# EAGLE design StappenMotorSturing (EAGLE 6.4)
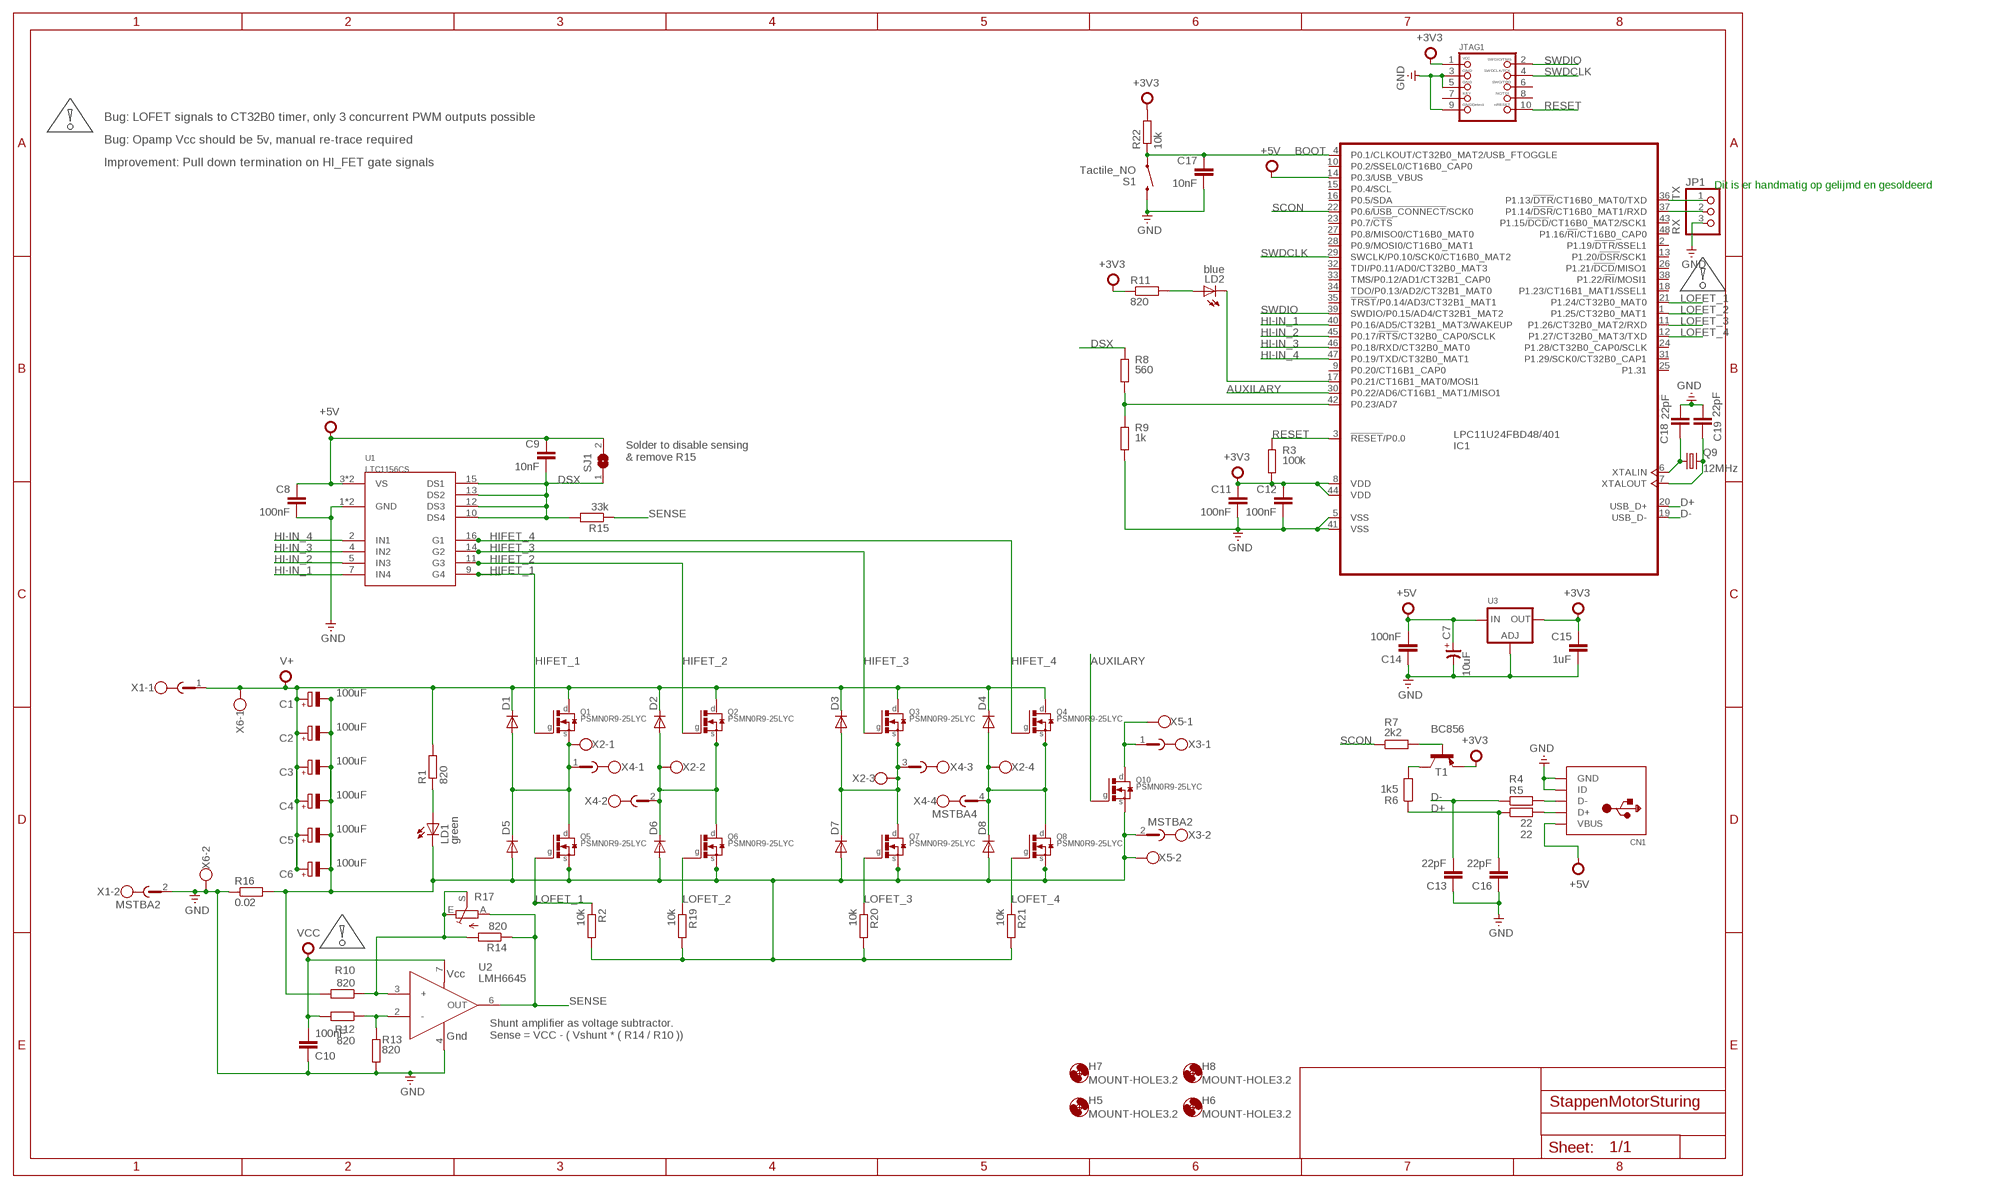
[diagram p0: schematic, sheet 1]

## Parts
C1  100uF  CPOL-EUE2.5-7  [E2,5-7]
C2  100uF  CPOL-EUE2.5-7  [E2,5-7]
C3  100uF  CPOL-EUE2.5-7  [E2,5-7]
C4  100uF  CPOL-EUE2.5-7  [E2,5-7]
C5  100uF  CPOL-EUE2.5-7  [E2,5-7]
C6  100uF  CPOL-EUE2.5-7  [E2,5-7]
C7  10uF  CP-3216-18W  [3216-18W/T]
C8  100nF  C-EUC0805  [C0805]
C9  10nF  C-EUC0805  [C0805]
C10  100nF  C-EUC0805  [C0805]
C11  100nF  C-EUC0805  [C0805]
C12  100nF  C-EUC0805  [C0805]
C13  22pF  C-EUC0805  [C0805]
C14  100nF  C-EUC0805  [C0805]
C15  1uF  C-EUC0805  [C0805]
C16  22pF  C-EUC0805  [C0805]
C17  10nF  C-EUC0805  [C0805]
C18  22pF  C-EUC0805  [C0805]
C19  22pF  C-EUC0805  [C0805]
CN1  USBMINIB  [USB-MINIB]
D1  DIODE-SOD80C  [SOD80C]
D2  DIODE-SOD80C  [SOD80C]
D3  DIODE-SOD80C  [SOD80C]
D4  DIODE-SOD80C  [SOD80C]
D5  DIODE-SOD80C  [SOD80C]
D6  DIODE-SOD80C  [SOD80C]
D7  DIODE-SOD80C  [SOD80C]
D8  DIODE-SOD80C  [SOD80C]
H5  MOUNT-HOLE3.2  [3,2]
H6  MOUNT-HOLE3.2  [3,2]
H7  MOUNT-HOLE3.2  [3,2]
H8  MOUNT-HOLE3.2  [3,2]
IC1  LPC11U24FBD48/401  [LQFP48]
JP1  HEADER-1X3  [1X03_OVAL]
JTAG1  JTAG-CORTEXM3  [2X05_1.27MM_SMT]
LD1  green  LEDCHIP-LED0805  [CHIP-LED0805]
LD2  blue  LEDCHIP-LED0805  [CHIP-LED0805]
Q1  PSMN0R9-25LYC  PSMN2R6-40YS  [SOT669]
Q2  PSMN0R9-25LYC  PSMN2R6-40YS  [SOT669]
Q3  PSMN0R9-25LYC  PSMN2R6-40YS  [SOT669]
Q4  PSMN0R9-25LYC  PSMN2R6-40YS  [SOT669]
Q5  PSMN0R9-25LYC  PSMN2R6-40YS  [SOT669]
Q6  PSMN0R9-25LYC  PSMN2R6-40YS  [SOT669]
Q7  PSMN0R9-25LYC  PSMN2R6-40YS  [SOT669]
Q8  PSMN0R9-25LYC  PSMN2R6-40YS  [SOT669]
Q9  12MHz  CRYSTAL5X3  [CRYSTAL-SMD-5X3]
Q10  PSMN0R9-25LYC  PSMN2R6-40YS  [SOT669]
R1  820  R-EU_R0805  [R0805]
R2  10k  R-EU_R0805  [R0805]
R3  100k  R-EU_R0805  [R0805]
R4  22  R-EU_R0805  [R0805]
R5  22  R-EU_R0805  [R0805]
R6  1k5  R-EU_R0805  [R0805]
R7  2k2  R-EU_R0805  [R0805]
R8  560  R-EU_R0805  [R0805]
R9  1k  R-EU_R0805  [R0805]
R10  820  R-EU_R0805  [R0805]
R11  820  R-EU_R0805  [R0805]
R12  820  R-EU_R0805  [R0805]
R13  820  R-EU_R0805  [R0805]
R14  820  R-EU_R0805  [R0805]
R15  33k  R-EU_R0805  [R0805]
R16  0.02  R-EU_R2512  [R2512]
R17  TRIM_EU-RS3  [RS3]
R19  10k  R-EU_R0805  [R0805]
R20  10k  R-EU_R0805  [R0805]
R21  10k  R-EU_R0805  [R0805]
R22  10k  R-EU_R0805  [R0805]
S1  Tactile_NO  SPARKFUN_TACTILE_MINI  [SPARKFUN_TACTILE_MINI]
SJ1  SJ  [SJ]
T1  BC856  BC856A-PNP-SOT23-BEC  [SOT23-BEC]
U1  LTC1156CS  [SOL16]
U2  LMH6645  [SOIC8]
U3  LM1117SOT223-WAVE  [SOT223-W]
X1  MSTBA2  [MSTBA2]
X2  W237-4  [W237-4]
X3  MSTBA2  [MSTBA2]
X4  MSTBA4  [MSTBA4]
X5  W237-102  [W237-102]
X6  W237-102  [W237-102]

## Nets
+3V3: C11.1 C12.1 C15.1 IC1.8(VDD) IC1.44(VDD) JTAG1.1 R3.2 R11.1 R22.2 T1.E U3.2(OUT)
+5V: C7.+ C8.1 C9.1 C14.2 CN1.VBUS IC1.14(P0.3/USB_VBUS) SJ1.2 U1.3(VS) U1.8(VS) U3.3(IN)
AUX+: Q10.5(D) X3.1 X5.1
AUXILARY: IC1.30(P0.22/AD6/CT16B1_MAT1/MISO1) Q10.4(G)
BOOT: C17.1 IC1.4(P0.1/CLKOUT/CT32B0_MAT2/USB_FTOGGLE) R22.1 S1.P$1
D+: C16.1 IC1.20(USB_D+) R5.1 R6.1
D-: C13.2 IC1.19(USB_D-) R4.1
DSX: C9.2 R8.1 R15.2 SJ1.1 U1.10(DS4) U1.12(DS3) U1.13(DS2) U1.15(DS1)
GND: C7.- C8.2 C10.1 C11.2 C12.2 C13.1 C14.1 C15.2 C16.2 C17.2 C18.1 C19.1 CN1.GND CN1.ID IC1.5(VSS) IC1.41(VSS) JP1.3 JTAG1.3 JTAG1.5 JTAG1.9 R9.2 R13.2 R16.1 S1.P$2 U1.1(GND) U1.6(GND) U2.4(GND) U3.1(ADJ) X1.2 X6.2
HI-IN_1: IC1.40(P0.16/AD5/CT32B1_MAT3/WAKEUP) U1.7(IN4)
HI-IN_2: IC1.45(P0.17/!RTS!/CT32B0_CAP0/SCLK) U1.5(IN3)
HI-IN_3: IC1.46(P0.18/RXD/CT32B0_MAT0) U1.4(IN2)
HI-IN_4: IC1.47(P0.19/TXD/CT32B0_MAT1) U1.2(IN1)
HIFET_1: Q1.4(G) U1.9(G4)
HIFET_2: Q2.4(G) U1.11(G3)
HIFET_3: Q3.4(G) U1.14(G2)
HIFET_4: Q4.4(G) U1.16(G1)
LOFET_1: IC1.21(P1.24/CT32B0_MAT0) Q5.4(G) R2.1
LOFET_2: IC1.1(P1.25/CT32B0_MAT1) Q6.4(G) R19.1
LOFET_3: IC1.11(P1.26/CT32B0_MAT2/RXD) Q7.4(G) R20.1
LOFET_4: IC1.12(P1.27/CT32B0_MAT3/TXD) Q8.4(G) R21.1
N$1: R10.1 R14.2 R17.E R17.S U2.3(+)
N$3: D1.A D5.C Q1.1(S) Q1.2(S) Q1.3(S) Q5.5(D) X2.1 X4.1
N$4: D2.A D6.C Q2.1(S) Q2.2(S) Q2.3(S) Q6.5(D) X2.2 X4.2
N$5: LD2.A R11.2
N$6: D4.A D8.C Q4.1(S) Q4.2(S) Q4.3(S) Q8.5(D) X2.4 X4.4
N$7: D3.A D7.C Q3.1(S) Q3.2(S) Q3.3(S) Q7.5(D) X2.3 X4.3
N$8: R12.1 R13.1 U2.2(-)
N$9: IC1.17(P0.21/CT16B1_MAT0/MOSI1) LD2.C
N$11: C1.- C2.- C3.- C4.- C5.- C6.- D5.A D6.A D7.A D8.A LD1.C Q5.1(S) Q5.2(S) Q5.3(S) Q6.1(S) Q6.2(S) Q6.3(S) Q7.1(S) Q7.2(S) Q7.3(S) Q8.1(S) Q8.2(S) Q8.3(S) Q10.3(S) R2.2 R10.2 R16.2 R19.2 R20.2 R21.2 X3.2 X5.2
N$13: LD1.A R1.1
N$14: CN1.D+ R5.2
N$15: CN1.D- R4.2
N$16: R6.2 T1.C
N$17: R7.2 T1.B
N$18: C18.2 IC1.6(XTALIN) Q9.1
N$19: C19.2 IC1.7(XTALOUT) Q9.3
N$27: IC1.42(P0.23/AD7) R8.2 R9.1
RESET: IC1.3(!RESET!/P0.0) JTAG1.10 R3.1
RX: IC1.37(P1.14/!DSR!/CT16B0_MAT1/RXD) JP1.2
SCON: IC1.22(P0.6/!USB_CONNECT!/SCK0) R7.1
SENSE: R14.1 R15.1 R17.A U2.6(OUT)
SWDCLK: IC1.29(SWCLK/P0.10/SCK0/CT16B0_MAT2) JTAG1.4
SWDIO: IC1.39(SWDIO/P0.15/AD4/CT32B1_MAT2) JTAG1.2
TX: IC1.36(P1.13/!DTR!/CT16B0_MAT0/TXD) JP1.1
V+: C1.+ C2.+ C3.+ C4.+ C5.+ C6.+ D1.C D2.C D3.C D4.C Q1.5(D) Q2.5(D) Q3.5(D) Q4.5(D) R1.2 X1.1 X6.1
VCC: C10.2 R12.2 U2.7(VCC)
Unconnected: IC1.2(P1.19/!DTR!/SSEL1) IC1.9(P0.20/CT16B1_CAP0) IC1.10(P0.2/SSEL0/CT16B0_CAP0) IC1.13(P1.20/!DSR!/SCK1) IC1.15(P0.4/SCL) IC1.16(P0.5/SDA) IC1.18(P1.23/CT16B1_MAT1/SSEL1) IC1.23(P0.7/!CTS!) IC1.24(P1.28/CT32B0_CAP0/SCLK) IC1.25(P1.31) IC1.26(P1.21/!DCD!/MISO1) IC1.27(P0.8/MISO0/CT16B0_MAT0) IC1.28(P0.9/MOSI0/CT16B0_MAT1) IC1.31(P1.29/SCK0/CT32B0_CAP1) IC1.32(TDI/P0.11/AD0/CT32B0_MAT3) IC1.33(TMS/P0.12/AD1/CT32B1_CAP0) IC1.34(TDO/P0.13/AD2/CT32B1_MAT0) IC1.35(!TRST!/P0.14/AD3/CT32B1_MAT1) IC1.38(P1.22/!RI!/MOSI1) IC1.43(P1.15/!DCD!/CT16B0_MAT2/SCK1) IC1.48(P1.16/!RI!/CT16B0_CAP0) JTAG1.6 JTAG1.7 JTAG1.8 Q10.1(S) Q10.2(S)

## Notes on the sheet
- Bug: LOFET signals to CT32B0 timer, only 3 concurrent PWM outputs possible
- Bug: Opamp Vcc should be 5v, manual re-trace required
- Improvement: Pull down termination on HI_FET gate signals
- Dit is er handmatig op gelijmd en gesoldeerd
- Solder to disable sensing
  & remove R15
- Shunt amplifier as voltage subtractor.
  Sense = VCC - ( Vshunt * ( R14 / R10 ))

## Library data of the parts
C1-C6 = rcl:CPOL-EU: POLARIZED CAPACITOR, European symbol
C7 = cap-master:CP-: POLARIZED CAP
C8-C19 = rcl:C-EU: CAPACITOR, European symbol
CN1 = microbuilder:USB: USB Connectors USBMINIB - Surface Mount Female Mini-B USB Connector 4UConnector: 06564
D1-D8 = diode:DIODE-: DIODE
H5-H8 = holes:MOUNT-HOLE: MOUNTING HOLE with drill center marker
IC1 = lpc11u24fbd48:LPC11U24FBD48
JP1 = microbuilder:HEADER-1X3: PIN HEADER
JTAG1 = microbuilder:JTAG-CORTEXM3: Serial Wire (SW-DP) Connector This standard 0.05" 10-pin connector is for use with the Cortex M0/M3's native SWD (serial wire debugger) interface (SW-DP). Some boards support a 20-pin combined JTAG+SWD connector (SWJ-DP), such as the LPC1700 family, but many smaller devices only work with SWD which typically use the smaller 10-pin SW-DP connecter (the LPC1300 family, for example, only supports SWD). 2x05 1.27mm/0.05" Connector: This is the standard SMT connector defined by ARM for all Cortex devices, and should be used in most situations and for forward-compatibility since any new devices coming to market will likely use this connector. MOLEX 10 Pin 0.1" Connector: This 0.1" 10 pin connector has the same pin layout as the standard 0.05" connector, but is easier to work with if you are using standard jumper wires or custom cables to connect your SWD hardware. MOLEX 20 Pin 0.1" Connector: This 0.1" 20 pin connector is the same model used for ARM7/ARM9 JTAG debuggers, but is connected to match the pins on the Segger J-Link for ARM (which supports both JTAG and SWD debugging). See the following document from ARM for more information on Cortex M3 Debug Connectors: http://infocenter.arm.com/help/topic/com.arm.doc.faqs/attached/13634/cortex_debug_connectors.pdf And the following page for an overview with images of the different connector types: http://www.keil.com/peripherals/coresight/connectors.asp
LD1 LD2 = led:LED: LED OSRAM: - CHIPLED LG R971, LG N971, LY N971, LG Q971, LY Q971, LO R971, LY R971 LH N974, LH R974 LS Q976, LO Q976, LY Q976 LO Q996 - Hyper CHIPLED LW Q18S LB Q993, LB Q99A, LB R99A - SideLED LS A670, LO A670, LY A670, LG A670, LP A670 LB A673, LV A673, LT A673, LW A673 LH A674 LY A675 LS A676, LA A676, LO A676, LY A676, LW A676 LS A679, LY A679, LG A679 - Hyper Micro SIDELED® LS Y876, LA Y876, LO Y876, LY Y876 LT Y87S - SmartLED LW L88C, LW L88S LB L89C, LB L89S, LG L890 LS L89K, LO L89K, LY L89K LS L896, LA L896, LO L896, LY L896 - TOPLED LS T670, LO T670, LY T670, LG T670, LP T670 LSG T670, LSP T670, LSY T670, LOP T670, LYG T670 LG T671, LOG T671, LSG T671 LB T673, LV T673, LT T673, LW T673 LH T674 LS T676, LA T676, LO T676, LY T676, LB T676, LH T676, LSB T676, LW T676 LB T67C, LV T67C, LT T67C, LS T67K, LO T67K, LY T67K, LW E67C LS E67B, LA E67B, LO E67B, LY E67B, LB E67C, LV E67C, LT E67C LW T67C LS T679, LY T679, LG T679 LS T770, LO T770, LY T770, LG T770, LP T770 LB T773, LV T773, LT T773, LW T773 LH T774 LS E675, LA E675, LY E675, LS T675 LS T776, LA T776, LO T776, LY T776, LB T776 LHGB T686 LT T68C, LB T68C - Hyper Mini TOPLED® LB M676 - Mini TOPLED Santana® LG M470 LS M47K, LO M47K, LY M47K Source: http://www.osram.convergy.de/
Q1-Q8 Q10 = NXP_FETS:PSMN2R6-40YS
Q9 = SparkFun:CRYSTAL: Crystals Various standard crystals. Proven footprints. Spark Fun Electronics SKU : COM-00534
R1-R15 R19-R22 = resistor:R-EU_: RESISTOR, European symbol
R16 = rcl:R-EU_: RESISTOR, European symbol
R17 = pot:TRIM_EU-: POTENTIOMETER
S1 = Q_copter:SPARKFUN_TACTILE_MINI: Momentary Reset Switch SMD sku: COM-08229
SJ1 = jumper:SJ: SMD solder JUMPER
T1 = transistor:*-PNP-: PNP Transistror
U1 = Jeroen:LTC1156: LTC1156 Quad High Side Micropower MOSFET Driver with Internal Charge Pump in SOL16 or DIP16 package
U2 = Jeroen:LMH6645: LMH6645/46/47 2.7V, 650μA, 55MHz, Rail-to-Rail Input and Output Amplifiers
U3 = microbuilder:LM1117: LM1117 Voltage Regulator LM1117 Adjustable Voltage regulator [Digikey: LM1117IMP-ADJDKR-ND] LM1117 3.3V Voltage regulator [AP1117E33GDIDKR-ND] LM1117 5.0V Voltage regulator [AP1117E50GDIDKR-ND] SOT223-REFLOW - SOT223 package for solder paste/reflow ovens SOT223-WAVE - SOT223 package for hand-soldering (larger pads) Note: For the fixed-voltage regulators, simply set the ADJ pin to GND.
X1 X3 = con-phoenix-508:MSTBA2: PHOENIX
X2 = con-wago-500:W237-4: WAGO SCREW CLAMP
X4 = con-phoenix-508:MSTBA4: PHOENIX
X5 X6 = con-wago-500:W237-102: WAGO SCREW CLAMP

## Board
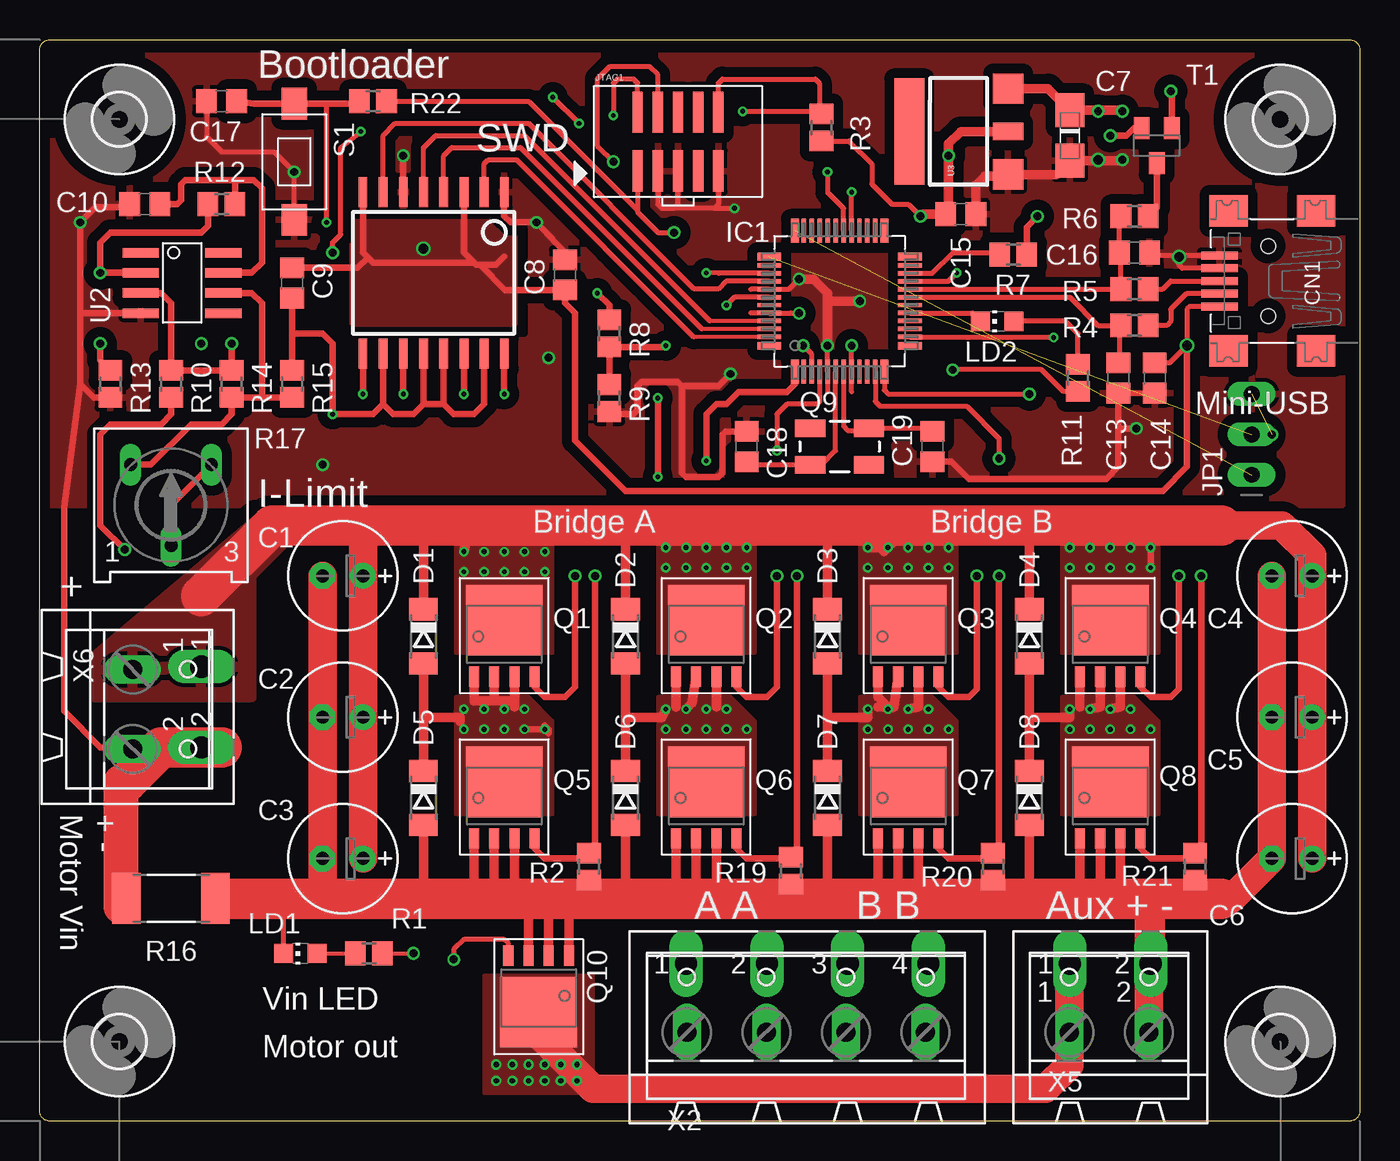
[diagram p1: board, top side]
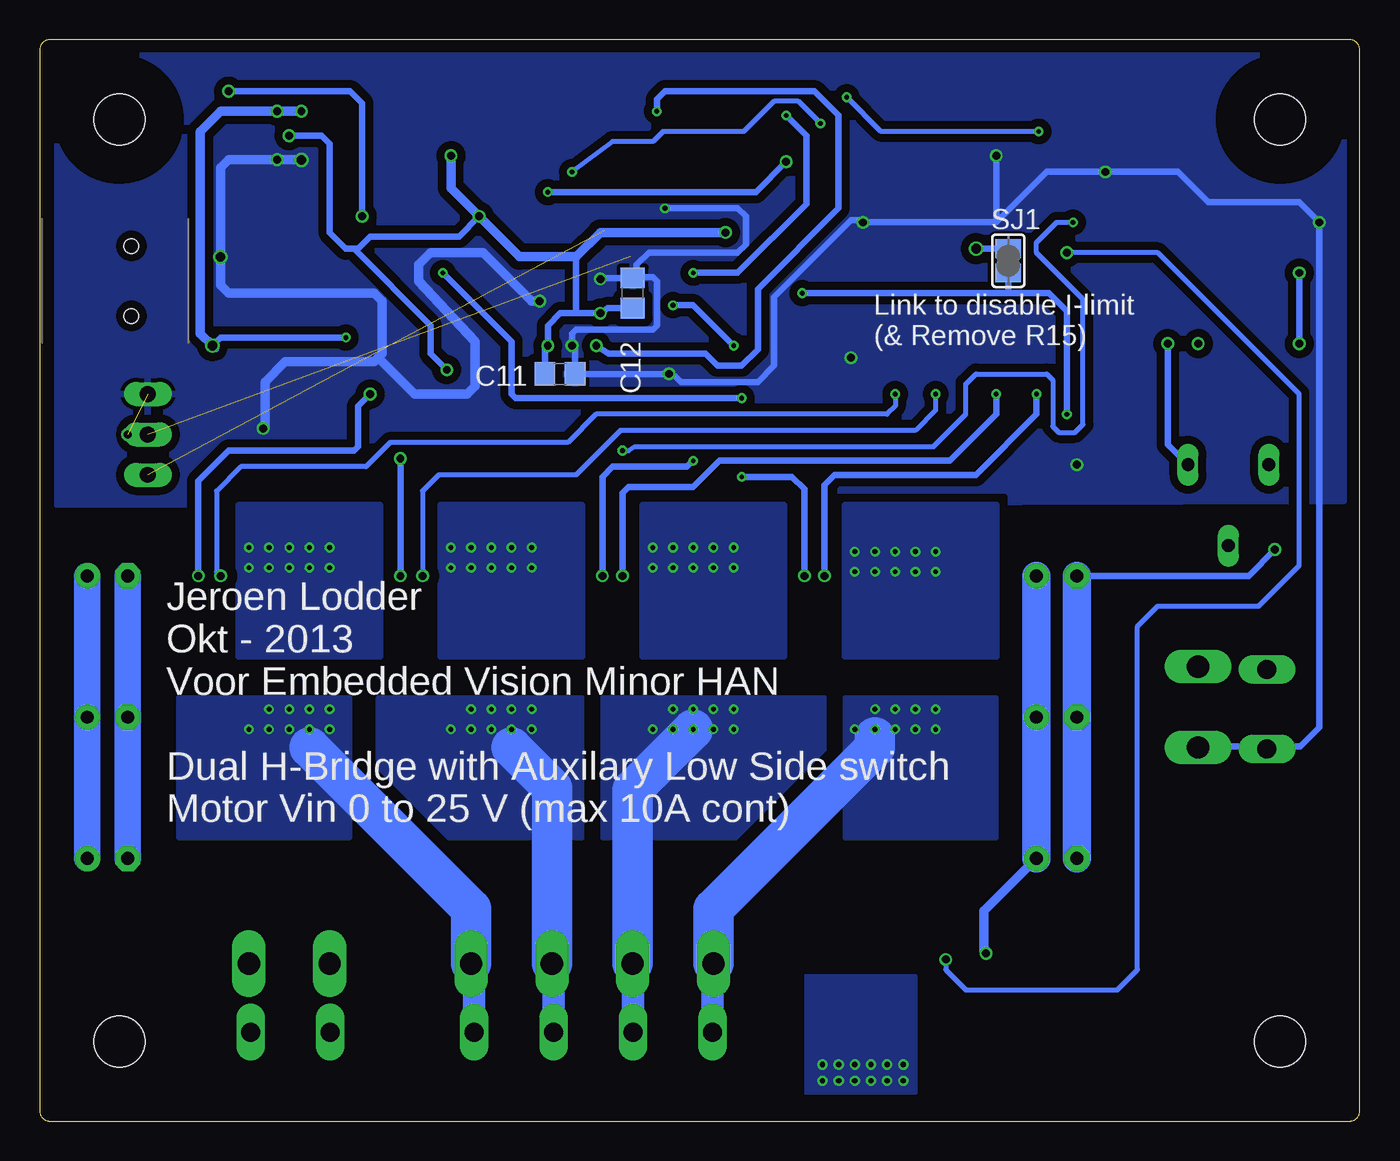
[diagram p2: board, bottom side, seen from below]

Size 83 x 68 mm. Coordinates in mm from the lower left corner, seen from the top.
Outline: 82.36,0 0.64,0 arc-90 0,0.64 0,67.36 arc-90 0.64,68 82.36,68 arc-90 83,67.36 83,0.64 arc-90 82.36,0
Copper layers (1*16): Top 0.035mm / dielectric 1.5mm / Bottom 0.035mm
Design rules "ITEADstudio_DRC": minimum track width 6mil, minimum drill 0.3mm, track to track 6mil, track to pad 6mil, pad to pad 6mil, via to via 6mil, smd to smd 0mil, copper to edge 10mil, drill to drill 10mil, minimum pad ring 10mil, minimum via ring 6mil, stop-mask expansion 2mil, vias tented up to drill 100mil, thermal gap 10mil

### Footprints (pad centres in the part's own frame; a part is rotated, then mirrored left to right if it is on the bottom)
E2,5-7 = drill 0.813 pad 1.6: + -1.27,0 | drill 0.813 pad 1.6 octagon: - 1.27,0
3216-18W/T = smd 2.15 x 1.8: + 1.587,0; - -1.587,0
C0805 = smd 1.3 x 1.5: 1 -0.95,0; 2 0.95,0
USB-MINIB = smd 0.5 x 2.308: D+ 0,4.064; D- -0.8,4.064; GND 1.6,4.064; ID 0.8,4.064; VBUS -1.6,4.064 | smd 2 x 2.4: GND1 -4.4,-2; GND2 -4.4,3.5; GND3 4.4,3.5; GND4 4.4,-2 | hole 0.9: -2.2,1; 2.2,1
SOD80C = smd 1.4 x 1.8: A 1.7,0; C -1.7,0
3,2 = hole 3.2: 0,0
LQFP48 = smd 0.5 x 1.5: 1 -2.81,-4.425; 12 2.81,-4.425; 25 2.81,4.425; 36 -2.81,4.425 | smd 0.28 x 1.5: 2 -2.25,-4.425; 3 -1.75,-4.425; 4 -1.25,-4.425; 5 -0.75,-4.425; 6 -0.25,-4.425; 7 0.25,-4.425; 8 0.75,-4.425; 9 1.25,-4.425; 10 1.75,-4.425; 11 2.25,-4.425; 26 2.25,4.425; 27 1.75,4.425; 28 1.25,4.425; 29 0.75,4.425; 30 0.25,4.425; 31 -0.25,4.425; 32 -0.75,4.425; 33 -1.25,4.425; 34 -1.75,4.425; 35 -2.25,4.425 | smd 1.5 x 0.5: 13 4.425,-2.81; 24 4.425,2.81; 37 -4.425,2.81; 48 -4.425,-2.81 | smd 1.5 x 0.28: 14 4.425,-2.25; 15 4.425,-1.75; 16 4.425,-1.25; 17 4.425,-0.75; 18 4.425,-0.25; 19 4.425,0.25; 20 4.425,0.75; 21 4.425,1.25; 22 4.425,1.75; 23 4.425,2.25; 38 -4.425,2.25; 39 -4.425,1.75; 40 -4.425,1.25; 41 -4.425,0.75; 42 -4.425,0.25; 43 -4.425,-0.25; 44 -4.425,-0.75; 45 -4.425,-1.25; 46 -4.425,-1.75; 47 -4.425,-2.25
1X03_OVAL = drill 1 long: 1 -2.54,0; 2 0,0; 3 2.54,0
2X05_1.27MM_SMT = smd 0.65 x 2.6: 1 -2.54,-1.85; 2 -2.54,1.85; 3 -1.27,-1.85; 4 -1.27,1.85; 5 0,-1.85; 6 0,1.85; 7 1.27,-1.85; 8 1.27,1.85; 9 2.54,-1.85; 10 2.54,1.85
CHIP-LED0805 = smd 1.2 x 1.2: A 0,-1.05; C 0,1.05
SOT669 = smd 0.635 x 1.27: 1 0,0; 2 1.27,0; 3 2.54,0; 4 3.81,0 | smd 4.826 x 4.445: 5 1.905,3.556
CRYSTAL-SMD-5X3 = smd 1.9 x 1.1: 1 -1.85,-1.15; 2 1.85,-1.15; 3 1.85,1.15; 4 -1.85,1.15
R0805 = smd 1.3 x 1.5: 1 -0.85,0; 2 0.85,0
R2512 = smd 1.8 x 3.2: 1 -2.8,0; 2 2.8,0
RS3 = drill 0.813 long: A -2.54,2.54; E 2.54,2.54; S 0,-2.54
SPARKFUN_TACTILE_MINI = smd 2 x 1.6: P$1 -3.65,0; P$2 3.65,0
SJ = smd 1.168 x 1.6: 1 -0.762,0; 2 0.762,0
SOT23-BEC = smd 1 x 1.4: B -0.95,-1.1; C 0,1.1; E 0.95,-1.1
SOL16 = smd 0.559 x 1.905: 1 -4.445,-5.08; 2 -3.175,-5.08; 3 -1.905,-5.08; 4 -0.635,-5.08; 5 0.635,-5.08; 6 1.905,-5.08; 7 3.175,-5.08; 8 4.445,-5.08; 9 4.445,5.08; 10 3.175,5.08; 11 1.905,5.08; 12 0.635,5.08; 13 -0.635,5.08; 14 -1.905,5.08; 15 -3.175,5.08; 16 -4.445,5.08
SOIC8 = smd 0.6 x 2.27: 1 -1.905,-2.54; 2 -0.635,-2.54; 3 0.635,-2.54; 4 1.905,-2.54; 5 1.905,2.66; 6 0.635,2.66; 7 -0.635,2.66; 8 -1.905,2.66
SOT223-W = smd 1.9 x 1.9: 1 -2.7,-3.1; 3 2.7,-3.1 | smd 1.1 x 1.9: 2 0,-3.1 | smd 6.7 x 1.9: 4 0,3.1
MSTBA2 = drill 1.397 long: 1 -2.54,5.08; 2 2.54,5.08
W237-4 = drill 1.194 long: 1 -7.5,-1.27; 2 -2.5,-1.27; 3 2.5,-1.27; 4 7.5,-1.27
MSTBA4 = drill 1.397 long: 1 -7.62,5.08; 2 -2.54,5.08; 3 2.54,5.08; 4 7.62,5.08
W237-102 = drill 1.194 long: 1 -2.5,-1.27; 2 2.5,-1.27

### Placement (x,y rotation side)
C1  19.05,34.29 180 top
C2  19.05,25.4 180 top
C3  19.05,16.51 180 top
C4  78.74,34.29 180 top
C5  78.74,25.4 180 top
C6  78.74,16.51 180 top
C7  64.77,61.98 90 top
C8  33.02,53.21 90 top
C9  15.88,52.7 270 top
C10  6.6,57.66 0 top
C11  50.29,46.99 0 bottom
C12  45.72,52.07 90 bottom
C13  67.82,46.74 90 top
C14  70.1,46.74 90 top
C15  57.91,57.02 0 top
C16  68.83,54.61 0 top
C17  11.43,64.14 180 top
C18  44.45,42.42 270 top
C19  56.13,42.42 90 top
CN1  78.25,52.83 90 top
D1  24.13,30.48 270 top
D2  36.83,30.48 270 top
D3  49.53,30.48 270 top
D4  62.23,30.48 270 top
D5  24.13,20.32 270 top
D6  36.83,20.32 270 top
D7  49.53,20.32 270 top
D8  62.23,20.32 270 top
H5  5,5 0 top
H6  78,5 0 top
H7  78,63 0 top
H8  5,63 0 top
IC1  50.29,51.56 0 top
JP1  76.2,43.18 90 top
JTAG1  40.13,61.59 0 top
LD1  16.38,10.54 90 top
LD2  60.2,50.29 90 top
Q1  27.3,27.94 0 top
Q2  40.01,27.94 0 top
Q3  52.7,27.94 0 top
Q4  65.41,27.94 0 top
Q5  27.3,17.78 0 top
Q6  40.01,17.78 0 top
Q7  52.7,17.78 0 top
Q8  65.41,17.78 0 top
Q9  50.29,42.42 0 top
Q10  33.27,10.41 180 top
R1  20.7,10.54 0 top
R2  34.54,16 270 top
R3  49.15,62.48 270 top
R4  68.83,50.04 0 top
R5  68.83,52.32 0 top
R6  68.83,56.9 0 top
R7  61.21,54.48 0 top
R8  35.81,49.53 270 top
R9  35.81,45.47 270 top
R10  8.26,46.35 270 top
R11  65.28,46.74 90 top
R12  11.43,57.66 0 top
R13  4.45,46.35 270 top
R14  12.06,46.35 90 top
R15  15.88,46.35 90 top
R16  8.26,14 0 top
R17  8.26,38.73 0 top
R19  47.24,15.75 270 top
R20  59.94,16 270 top
R21  72.64,16 270 top
R22  20.95,64.14 0 top
S1  16,60.33 270 top
SJ1  22.1,54.1 90 bottom
T1  70.23,61.34 180 top
U1  24.77,53.34 180 top
U2  8.89,52.7 270 top
U3  57.78,62.23 90 top
X1  5.08,26.04 270 top
X2  48.19,6.86 0 top
X3  67.31,4.83 0 top
X4  48.26,4.83 0 top
X5  67.24,6.86 0 top
X6  7.11,25.91 270 top

### Tracks (layer width: path | path; a pad name or v marks a point on that pad's centre or on a via)
+3V3  (via drill 0.5)
  Top 0.305: JTAG1.1 37.59,57.28 | 37.59,57.28 37.59,57.15 38.86,55.88 v39.88,55.88 | 44.72,50.81 IC1.44 47.23,50.81 v47.75,50.8 | v51.05,48.77 51.04,49.01 IC1.8 51.04,45.87 | R3.2 50.89,61.63 52.32,60.2 52.32,58.93 53.59,57.66 54.61,57.66 v55.37,56.9 | R11.1 64.35,45.89 62.99,47.24 v57.4,47.24 | R22.2 30.73,64.14 37.59,57.28
  Top 0.406: T1.E 68.79,62.44 68.33,61.98 v67.31,61.98
  Top 0.61: U3.2 57.91,62.23 57.15,61.47 v57.15,60.71 57.15,57.21 C15.1 55.5,57.02 v55.37,56.9
  Bottom 0.305: 51.24,48.58 v51.05,48.77
  Bottom 0.406: 49.28,50.8 v47.75,50.8 47.31,51.12 C12.1 | 49.28,50.8 50.29,50.8 51.05,50.04 v51.05,48.77 | C11.1 51.24,48.58 | 49.28,54.36 49.28,50.8 | v67.31,61.98 65.28,61.98 64.77,61.47 64.77,55.88 63.75,54.86 63.25,54.86 | v57.4,47.24 58.42,48.26 58.42,50.04 63.25,54.86 | 63.25,54.86 62.99,54.86 62.23,55.63 56.64,55.63 v55.37,56.9
  Bottom 0.61: v39.88,55.88 47.75,55.88 49.28,54.36 52.83,54.36 v55.37,56.9 | v55.37,56.9 55.5,57.02 | v55.37,56.9 57.15,58.67 v57.15,60.71
+5V  (via drill 0.3, 0.5, 0.6)
  Top 0.305: CN1.VBUS 72.31,51.23 72.14,51.05 v72.14,48.77 71.05,47.69 C14.2 | 33.02,52.01 32.26,52.26 | IC1.14 63.72,49.31 v63.75,49.28
  Top 0.406: U1.3 26.67,54.61 27.3,53.98 | U1.8 20.32,54.61 20.64,54.29 | 20.64,54.29 20.95,53.98 27.3,53.98 | 20.64,54.29 20,53.66 C9.1 | 29.21,54.36 28.7,53.85 27.69,53.85 | 27.69,53.85 27.43,53.85 27.3,53.98 | C8.1 32.26,52.26 29.27,52.26 27.69,53.85 | v72.14,48.77 72.14,41.15 70.61,39.62 36.83,39.62 33.66,42.8 33.66,50.8 33.02,51.44 33.02,52.01
  Top 0.61: 66.99,63.56 C7.+ 63.4,64.93 U3.3 | 66.99,63.56 v66.55,63.5 | 66.99,63.56 68.01,63.56
  Bottom 0.305: 71.88,48.51 v72.14,48.77
  Bottom 0.406: v63.75,49.28 71.63,49.28 v72.14,48.77 | SJ1.2 v24.13,54.86
  Bottom 0.61: v72.14,48.77 72.9,49.53 72.9,62.23 71.63,63.5 v68.07,63.5 v66.55,63.5
  pour Top (isolate 0.635): 29.84,50.16 29.84,56.52 19.68,56.52 19.68,50.16
AUX+  (via drill 0.33)
  Top 1.778: X3.1 64.74,9.87 X5.1 64.74,3.52 63.25,2.03 34.8,2.03 30.73,6.1
  other vias: 29.72,2.54 28.7,3.56 28.7,2.54 30.73,3.56 29.72,3.56 31.75,2.54 30.73,2.54 32.77,2.54 31.75,3.56 32.77,3.56 33.78,3.56 33.78,2.54
  pour Top (isolate 0.127, no thermals): 27.94,9.14 27.94,1.78 34.8,1.78 34.8,9.14
  pour Bottom (isolate 0.127, no thermals): 27.94,9.14 27.94,1.78 34.8,1.78 34.8,9.14
AUXILARY  (via drill 0.3, 0.5)
  Top 0.305: IC1.30 50.54,57.41 49.53,58.42 v49.53,59.69 | Q10.4 29.46,11.18 29.21,11.43 26.67,11.43 26.04,10.79 v26.04,10.16 | v32.26,64.39 v33.91,62.74 | v20.19,62.23 18.92,61.21 18.92,55.75 18.41,55.24 v18.41,54.61
  Bottom 0.305: v26.04,10.16 26.04,9.53 24.77,8.26 15.24,8.26 13.97,9.53 13.97,31.11 12.7,32.38 6.35,32.38 3.81,34.92 3.81,45.72 12.7,54.61 v18.41,54.61 | v49.53,59.69 46.99,61.59 44.45,61.59 43.81,62.23 38.73,62.23 36.83,64.14 35.31,64.14 v33.91,62.74 | v32.26,64.39 30.1,62.23 v20.19,62.23
BOOT  (via drill 0.3)
  Top 0.305: IC1.4 49.04,45.23 48.9,45.09 46.99,45.09 46.35,44.45 v46.35,42.16 | v18.03,56.52 18.03,63.98
  Top 0.406: C17.1 13.49,63.98 S1.P$1 18.03,63.98 19.95,63.98 R22.1
  Bottom 0.305: v46.35,42.16 45.97,42.16 45.59,42.42 26.8,42.42 24.77,44.45 24.77,46.35 24.13,46.99 19.68,46.99 19.3,46.61 19.3,43.69 18.92,43.31 17.91,43.31 17.4,43.81 17.4,51.69 20.32,54.61 20.32,55.24 19.05,56.52 v18.03,56.52
D+
  Top 0.305: IC1.20 R5.1 67.98,54.51 C16.1 67.88,56.8 R6.1
D-
  Top 0.305: IC1.19 64.77,51.81 66.55,50.04 R4.1 67.88,49.94 67.88,47.75 C13.2
DSX  (via drill 0.3)
  Top 0.406: R15.2 15.88,49.53 | 15.88,49.53 C9.2 | U1.15 27.94,45.09 27.3,44.45 26.04,44.45 25.4,45.09 | 25.4,45.09 U1.13 | 24.13,45.09 23.5,44.45 22.23,44.45 21.59,45.09 | U1.12 24.13,45.09 | U1.10 21.59,45.09 | 21.59,45.09 20.95,44.45 v18.41,44.45 18.41,48.9 17.78,49.53 15.88,49.53 | 24.13,45.09 25.4,45.09 | v35.05,52.07 35.81,51.31 R8.1
  Bottom 0.406: v35.05,52.07 22.1,52.07 | 22.1,52.07 19.56,52.07 18.41,50.93 v18.41,44.45 | SJ1.1 22.1,52.07
GND  (via drill 0.3, 0.5, 0.6)  (1 unrouted)
  Top 0.305: CN1.GND 71.63,54.43 | 71.63,54.43 69.96,54.43 C16.2 | C13.1 C14.1 | CN1.ID 71.84,53.63 71.63,53.85 v71.63,54.36 71.63,54.43 | JTAG1.3 38.86,57.66 39.12,57.4 39.88,57.4 | 39.88,57.4 40.13,57.66 JTAG1.5 | JTAG1.9 42.67,57.66 42.42,57.4 | 42.42,57.4 39.88,57.4 | 44.72,52.31 IC1.41 47.1,52.31 v47.75,52.96 48.13,52.96 | v49.53,48.77 49.54,49.01 IC1.5 49.53,45.85 | 42.42,57.4 v43.69,57.4 | S1.P$2 v16,59.69 14.73,60.96 11.43,60.96 10.48,61.91 C17.2
  Top 0.406: 40.39,46.23 40.13,46.48 37.85,46.48 37.59,46.23 37.59,44.7 37.34,44.45 35.98,44.45 R9.2 | C19.1 57.34,41.47 58.42,40.39 67.06,40.39 67.82,41.15 67.82,43.43 | 67.82,43.43 C13.1 | C18.1 43.11,43.37 42.93,43.18 42.93,40.77 42.67,40.51 40.64,40.51 40.39,40.77 40.39,46.23 | 40.39,46.23 42.67,46.23 v43.43,46.99 | v68.96,43.56 67.94,43.56 67.82,43.43 | 2.54,50.8 U2.4 | 2.54,50.8 v2.54,56.52 3.5,57.47 5.47,57.47 C10.1 | 2.54,46.35 2.54,50.8 | R13.2 3.39,45.51 2.54,46.35 | 2.54,46.35 1.52,38.61 1.52,25.78 3.81,23.5 6.86,23.5 7.62,23.5 | 33.02,54.61 32.91,54.73 | 32.91,54.73 v31.24,56.52 29.59,56.52 29.21,56.9 U1.1 | U1.6 v22.86,60.71 | C8.2 33.02,54.62 32.91,54.73
  Top 0.61: U3.1 61.47,59.53 | 61.47,59.53 63.91,59.53 C7.- 66.74,60.39 | C15.2 58.86,58.86 59.44,59.44 61.37,59.44 61.47,59.53 | 66.74,60.39 v66.55,60.45 | 66.74,60.39 68.01,60.39 | 48.13,52.96 48.64,52.96 49.53,52.07 49.53,51.56 | v49.53,48.77 49.53,51.56 | 49.53,51.56 v51.56,51.56
  Top 1.016: R16.1 5.1,14
  Top 1.27: X6.2 6.86,23.41 6.86,23.5
  Top 2.184: 5.46,21.33 5.1,21.33 5.1,14 5.1,13.5
  Top 2.54: 5.46,21.33 7.62,23.5 X1.2 11.43,23.5
  Bottom 0.305: 49.34,48.58 v49.53,48.77 | 45.47,52.77 C12.2
  Bottom 0.406: C12.2 47.56,53.02 v47.75,52.96 | 49.34,48.58 C11.2 v43.43,46.99 43.18,46.99 42.67,46.48 37.85,46.48 36.83,47.5 36.83,51.82 32,56.64 31.37,56.64 v31.24,56.52 22.86,56.52 | v43.69,57.4 39.12,57.4 38.61,56.9 38.61,55.12 39.12,54.61 44.7,54.61 45.47,53.85 45.47,53.09 | 45.47,53.09 45.47,52.77 | v49.53,48.77 49.53,49.53 49.28,49.78 44.45,49.78 44.2,50.04 44.2,52.83 44.45,53.09 45.47,53.09 | 45.47,53.09 45.72,53.09 | 2.54,56.39 2.54,24.77 3.75,23.56 10.1,23.56 X1.2 | 22.86,56.52 v22.86,60.71 | 22.86,56.52 19.68,59.69 v16,59.69 11.43,59.69 9.53,57.78 3.81,57.78 v2.54,56.52
  Bottom 0.61: v66.55,60.45 v68.07,60.45 71.12,60.45 71.63,59.94 v71.63,54.36 | v71.63,54.36 71.63,54.1 | 61.72,48.01 61.47,48.26 61.47,51.56 61.98,52.07 71.12,52.07 71.63,52.58 v71.63,54.36 | 61.72,48.01 61.98,47.75 67.56,47.75 68.83,46.48 68.83,43.69 v68.96,43.56 | v51.56,51.56 52.07,51.56 55.12,54.61 58.42,54.61 59.18,53.85 59.18,52.83 55.63,49.02 55.63,46.23 56.13,45.72 59.44,45.72 61.72,48.01
  other vias: 17.78,41.27 77.47,43.18 32,48
  pour Bottom (isolate 0.508, rank 5): 1,39 81.92,38.73 81.92,67.04 1,67
  pour Top (isolate 0.635, rank 5): 0.76,38.7 81.92,38.73 81.92,67.04 0.76,67.01
HI-IN_1
  Top 0.305: IC1.40 43.16,52.81 42.67,52.32 41.15,52.32 30.73,62.74 22.35,62.74 21.59,61.98 U1.7
HI-IN_2
  Top 0.254: IC1.45 42.14,50.31
  Top 0.305: U1.5 24.13,61.21 24.89,61.98 30.48,61.98 42.14,50.31
HI-IN_3
  Top 0.254: IC1.46 41.63,49.81
  Top 0.305: U1.4 25.4,60.71 25.91,61.21 30.23,61.21 41.63,49.81
HI-IN_4
  Top 0.254: IC1.47 41.11,49.31
  Top 0.305: U1.2 27.94,60.2 28.19,60.45 29.97,60.45 41.11,49.31
HIFET_1  (via drill 0.3, 0.5)
  Top 0.406: v33.66,34.29 33.66,27.3 33.02,26.67 31.75,26.67 31.11,27.3 Q1.4 | U1.9 v20.32,45.72
  Bottom 0.406: v33.66,34.29 33.66,40.01 33.02,40.64 24.13,40.64 20.32,44.45 v20.32,45.72
HIFET_2  (via drill 0.3, 0.5)
  Top 0.406: v46.35,34.29 46.35,27.3 45.72,26.67 44.45,26.67 43.81,27.3 Q2.4 | U1.11 v22.86,45.72
  Bottom 0.406: v22.86,45.72 22.86,44.45 25.78,41.53 40.26,41.53 41.91,39.88 45.97,39.88 46.35,39.5 v46.35,34.29
HIFET_3  (via drill 0.3, 0.5)
  Top 0.406: U1.14 v26.67,45.72 | Q3.4 56.52,27.3 57.15,26.67 58.42,26.67 58.93,27.18 v58.93,34.29
  Bottom 0.305: v26.67,45.72 26.67,44.7 27.94,43.43 46.48,43.43 49.28,40.64 57.91,40.64 58.93,39.62 v58.93,34.29
HIFET_4  (via drill 0.3, 0.5)
  Top 0.406: U1.16 v29.21,45.72 | Q4.4 69.22,27.3 69.85,26.67 71.12,26.67 71.63,27.18 v71.63,34.29
  Bottom 0.305: v29.21,45.72 29.21,44.96 29.72,44.45 48.01,44.45 49.78,42.67 60.96,42.67 62.48,41.15 70.36,41.15 71.88,39.62 71.88,34.54 v71.63,34.29
LOFET_1  (via drill 0.3, 0.5)
  Top 0.305: IC1.21 57.13,52.81 v57.66,53.34
  Top 0.406: Q5.4 31.11,17.14 31.75,16.51 34.29,16.51 34.54,16.76 | 34.54,16.76 34.92,17.14 v34.92,34.29 | v38.86,40.51 v38.86,45.47 | R2.1 34.54,16.76
  Bottom 0.406: v34.92,34.29 34.92,39.75 35.69,40.51 v38.86,40.51 | v38.86,45.47 53.09,45.47 53.34,45.72 53.34,49.02 v57.66,53.34
LOFET_2  (via drill 0.3, 0.5)
  Top 0.406: Q6.4 43.81,17.14 44.45,16.51 46.99,16.51 47.24,16.76 | 47.24,16.76 47.62,17.14 v47.62,34.29 | IC1.1 47.5,47.12 47.5,46.35 46.99,45.85 43.94,45.85 43.18,45.09 42.55,45.09 41.91,44.45 v41.91,41.53 | R19.1 47.24,16.76
  Bottom 0.406: v47.62,34.29 47.62,40.51 46.99,41.15 42.29,41.15 v41.91,41.53
LOFET_3  (via drill 0.5)
  Top 0.305: IC1.11 52.54,45.25 52.83,44.96 58.29,44.96 60.33,42.93 v60.33,41.66
  Top 0.406: Q7.4 56.52,17.14 57.15,16.51 59.69,16.51 60.03,16.85 | 60.03,16.85 60.33,17.14 v60.33,34.29 | R20.1 60.03,16.85
  Bottom 0.406: v60.33,34.29 v60.33,41.66
LOFET_4  (via drill 0.5)
  Top 0.305: IC1.12 53.1,45.96 53.34,45.72 v62.23,45.72
  Top 0.406: Q8.4 69.22,17.14 69.85,16.51 72.39,16.51 72.64,16.76 | 72.64,16.76 73.03,17.14 v73.03,34.29 | R21.1 72.64,16.76
  Bottom 0.406: v73.03,34.29 73.03,40.26 71.12,42.16 63.25,42.16 62.99,42.42 62.99,44.96 v62.23,45.72
N$1  (via drill 0.5)
  Top 0.406: U2.3 7.62,52.07 8.26,51.44 R10.1 R14.2 v12.06,48.9 | R17.S 8.26,38.73 R17.E
  Bottom 0.406: v12.06,48.9 12.06,42.55 R17.E
N$2  (via drill 0.5)
  other vias: 10.16,48.9
N$3  (via drill 0.3)
  Top 0.406: v30.48,24.64 v31.75,24.64 | v31.75,24.64 32,24.38 32,24.64 31.75,24.89 v31.75,24.64
  Top 0.61: Q1.1 27.3,26.42 28.57,26.42 | 28.57,26.42 29.72,26.42 | D1.A 24.13,25.4 | 24.13,25.4 D5.C | 26.42,25.15 26.42,25.4 24.13,25.4 | Q1.2 28.57,26.42 | Q1.3 29.84,26.04
  Bottom 1.422: X2.1 40.69,9.86 X4.1
  Bottom 2.54: X4.1 40.64,13.34 30.48,23.5 30.48,24.13
  other vias: 26.67,24.64 27.94,24.64 29.21,24.64 26.67,25.91 27.94,25.91 29.21,25.91 30.48,25.91
  pour Top (isolate 0.127, no thermals): 32.26,19.3 32.26,25.15 30.73,26.67 26.16,26.67 26.16,19.3
  pour Bottom (isolate 0.762, rank 2, no thermals): 32.38,17.78 32.38,26.67 22.86,26.67 22.86,17.78
N$4  (via drill 0.3)
  Top 0.61: D6.C 36.83,25.4 | D2.A 36.83,25.4 | 36.83,25.4 39.12,25.4 v39.37,25.91 | v40.64,25.91 41.02,26.29 Q2.2 | Q2.1 40.01,26.04 | Q2.3 42.55,26.04
  Bottom 1.422: X2.2 45.69,9.87 X4.2
  Bottom 2.54: X4.2 45.72,20.83 v41.91,24.64
  other vias: 39.37,24.64 40.64,24.64 43.18,24.64 41.91,25.91 43.18,25.91 44.45,24.64
  pour Top (no thermals): 44.96,19.3 44.96,25.15 43.43,26.67 38.86,26.67 38.86,19.3
  pour Bottom (isolate 0.762, rank 2, no thermals): 47.62,17.78 47.62,26.67 33.66,26.67 33.66,17.78
N$5
  Top 0.305: R11.2 65.28,49.53 64.52,50.29 LD2.A
N$6  (via drill 0.3)
  Top 0.61: 62.23,25.4 D8.C | D4.A 62.23,25.4 | 62.23,25.4 64.77,25.4 v64.77,25.91 | v67.31,25.91 67.94,26.04 Q4.3 | v66.04,25.91 66.67,26.04 Q4.2 | Q4.1 65.41,26.04
  Bottom 1.422: X2.4 55.69,9.71 X4.4
  Bottom 2.54: X4.4 55.88,13.34 66.04,23.5
  other vias: 64.77,24.64 66.04,24.64 67.31,24.64 68.58,24.64 68.58,25.91 69.85,24.64
  pour Top (no thermals): 70.36,19.3 70.36,25.15 68.83,26.67 64.26,26.67 64.26,19.3
  pour Bottom (isolate 1.27, rank 2, no thermals): 74.3,17.78 74.3,26.67 63.5,26.67 63.5,17.78
N$7  (via drill 0.3)
  Top 0.61: 49.53,25.4 D7.C | D3.A 49.53,25.4 | 49.53,25.4 52.07,25.4 v52.07,25.91 | v54.61,25.91 55.24,26.04 Q3.3 | v53.34,25.91 53.72,26.04 Q3.2 | Q3.1 52.7,26.67 53.34,26.04 52.7,26.04
  Bottom 1.422: X2.3 50.69,9.79 X4.3
  Bottom 2.54: X4.3 50.8,20.95 53.34,23.5
  other vias: 52.07,24.64 53.34,24.64 54.61,24.64 55.88,24.64 55.88,25.91 57.15,24.64
  pour Top (no thermals): 57.66,19.3 57.66,25.15 56.13,26.67 51.56,26.67 51.56,19.3
  pour Bottom (isolate 0.762, rank 2, no thermals): 61.72,17.78 61.72,26.67 48.9,26.67 48.9,17.78
N$8  (via drill 0.5)
  Top 0.406: U2.2 v3.81,53.34 3.81,55.24 4.45,55.88 10.16,55.88 10.58,56.3 R12.1 | v3.81,48.9 3.81,47.84 R13.1
  Bottom 0.406: v3.81,48.9 v3.81,53.34
N$9
  Top 0.305: IC1.17 58.66,50.81 58.93,50.55 59.18,50.26 LD2.C
N$11  (via drill 0.5)
  Top 0.305: LD1.C 15.33,13.88 15.24,13.97
  Top 0.406: 34.54,14.22 34.54,13.72 | 34.54,14.22 46.57,14.22 R19.2 48.17,13.97 59.69,13.97 59.94,14.22 R20.2 59.94,13.97 65.02,13.97 69.85,13.97 71.46,13.97 R21.2 | R2.2 34.54,14.22 | 34.54,14.22 34.29,13.97 | R10.2 8.26,44.45 7.62,43.81 4.45,43.81 3.81,43.18 3.81,37.47 v5.33,35.94 | Q8.3 67.94,14.1 68.07,13.97 | 11.43,13.97 11.09,13.97 R16.2
  Top 0.61: D5.A 24.13,13.97 | D8.A 62.23,13.97 | Q6.1 40.01,13.97 | Q7.1 52.7,13.97 | Q8.1 65.41,13.97 | D6.A 36.83,13.97 | D7.A 49.53,13.97 | Q5.1 27.3,13.97 | Q8.3 67.94,14.61 | Q8.2 66.67,13.97 | Q7.3 55.24,13.97 | Q7.2 53.98,13.97 | Q6.3 42.55,13.97 | Q6.2 41.27,13.97 | Q5.3 29.84,13.97 | Q5.2 28.57,13.97 | 33.27,10.41 33.27,13.97 | 32,10.41 32,13.97 | Q10.3 30.73,13.72 30.99,13.97
  Top 1.27: 16.35,14.13 15.55,13.97
  Top 1.778: C1.- C2.- C3.- 17.78,14.61 17.14,13.97 | 74.3,13.97 74.93,13.97 C6.- C5.- C4.- | 64.77,13.72 65.02,13.97 | X5.2 69.74,13.86 69.85,13.97 X3.2
  Top 2.54: 74.3,13.97 69.85,13.97 68.07,13.97 66.67,13.97 65.41,13.97 65.02,13.97 62.23,13.97 55.24,13.97 53.98,13.97 52.7,13.97 49.53,13.97 42.55,13.97 41.27,13.97 40.01,13.97 36.83,13.97 34.29,13.97 33.27,13.97 32,13.97 30.99,13.97 29.84,13.97 28.57,13.97 27.3,13.97 24.13,13.97 17.14,13.97 15.55,13.97 15.24,13.97 11.43,13.97
  Bottom 0.406: v5.33,35.94 6.99,34.29 C1.-
  Bottom 1.676: C6.- C4.-
  Bottom 1.778: C3.- C1.-
N$13
  Top 0.254: LD1.A R1.1
N$14
  Top 0.305: R5.2 70.61,52.32 71.12,52.83 CN1.D+
N$15
  Top 0.305: CN1.D- 72.1,52.03 71.12,51.05 71.12,50.29 70.87,50.04 R4.2
N$16
  Top 0.406: T1.C 70.23,57.44 R6.2
N$17  (via drill 0.5)
  Top 0.406: T1.B 71.18,64.71 v71.12,64.77 | R7.2 62.06,56.22 v62.74,56.9
  Bottom 0.406: v71.12,64.77 63.5,64.77 62.74,64.01 v62.74,56.9
N$18
  Top 0.305: IC1.6 50.04,42.16 49.14,41.27 Q9.1 44.65,41.27 C18.2
N$19
  Top 0.305: IC1.7 50.54,43.69 50.8,43.43 52.01,43.43 Q9.3 55.93,43.57 C19.2
N$27  (via drill 0.3)
  Top 0.305: IC1.42 43.68,51.81 v43.18,51.31
  Top 0.406: R9.1 R8.2 39.28,48.68 v39.37,48.77
  Bottom 0.406: v43.18,51.31 41.91,51.31 v39.37,48.77
RESET  (via drill 0.3, 0.5)
  Top 0.305: JTAG1.10 42.67,65.28 42.93,65.53 48.77,65.53 49.02,65.28 49.02,63.46 R3.1 48.98,63.5 v44.2,63.5 | IC1.3 48.54,48.23 v48.01,48.77
  Bottom 0.406: v44.2,63.5 44.2,64.26 43.69,64.77 34.29,64.77 32.77,63.25 32.77,57.4 37.85,52.32 37.85,48.51 38.86,47.5 40.39,47.5 41.15,48.26 47.24,48.26 v48.01,48.77
RX  (1 unrouted)
SCON
  Top 0.305: IC1.22 56.11,53.31 57.4,54.61 60.24,54.61 R7.1
SENSE
  Top 0.406: U2.6 13.34,52.07 13.97,51.44 13.97,45.51 | R17.A 6.99,41.27 9.53,43.81 11.43,43.81 12.06,44.45 R14.1 13.97,45.51 | 13.97,45.51 R15.1
SWDCLK  (via drill 0.3, 0.5)
  Top 0.305: JTAG1.4 38.86,65.79 38.35,66.29 35.81,66.29 35.05,65.53 35.05,61.34 v36.07,60.33 | IC1.29 51.04,58.41 v51.05,58.42
  Bottom 0.406: v51.05,58.42 37.97,58.42 v36.07,60.33
SWDIO  (via drill 0.3)
  Top 0.305: IC1.39 42.7,53.31 v41.91,53.34 | JTAG1.2 37.59,65.28 37.34,65.53 36.32,65.53 36.07,65.28 v36.07,63.25
  Bottom 0.406: v41.91,53.34 39.12,53.34 34.8,57.66 34.8,61.98 v36.07,63.25
TX  (1 unrouted)
V+  (via drill 0.3, 0.5)
  Top 0.254: R1.2 v23.5,10.54
  Top 0.406: v69.85,34.8 69.85,35.81
  Top 0.61: D1.C 24.13,37.47 | D2.C 36.83,37.47 | D3.C 49.53,37.47 | D4.C 62.23,37.47 | v39.37,36.07 39.62,37.21 39.37,37.47 | v52.07,36.07 52.83,36.07 53.09,35.81 53.72,36.45 53.09,36.45 52.07,37.47 | v64.77,36.07 65.02,37.21 64.77,37.47 | v26.67,35.81 26.92,37.21 26.67,37.47
  Top 1.27: 67.31,32.18 Q4.5
  Top 1.778: C3.+ C2.+ C1.+ 20.32,37.47 | 74.3,37.47 78.11,37.47 80.01,35.56 C4.+ C5.+ C6.+
  Top 2.54: 74.3,37.47 64.77,37.47 62.23,37.47 52.07,37.47 49.53,37.47 39.37,37.47 36.83,37.47 26.67,37.47 24.13,37.47 20.32,37.47 14.61,37.47 10.16,33.02
  Bottom 0.61: C3.+ 23.62,13.21 23.62,10.67 v23.5,10.54
  Bottom 1.676: C6.+ C4.+
  Bottom 1.778: C1.+ C3.+
  other vias: 26.67,34.54 27.94,34.54 29.21,34.54 30.48,34.54 27.94,35.81 29.21,35.81 30.48,35.81 39.37,34.8 40.64,34.8 41.91,34.8 43.18,34.8 40.64,36.07 41.91,36.07 43.18,36.07 52.07,34.8 53.34,34.8 54.61,34.8 55.88,34.8 53.34,36.07 54.61,36.07 55.88,36.07 64.77,34.8 66.04,34.8 67.31,34.8 68.58,34.8 66.04,36.07 67.31,36.07 68.58,36.07 31.75,35.81 31.75,34.54 44.45,34.8 44.45,36.07 57.15,36.07 57.15,34.8 69.85,36.07
  pour Top (no thermals): 32.26,29.46 32.26,36.83 26.16,36.83 26.16,29.46
  pour Top (no thermals): 44.96,29.46 44.96,36.83 38.86,36.83 38.86,29.46
  pour Top (no thermals): 57.66,29.46 57.66,36.83 51.56,36.83 51.56,29.46
  pour Top (no thermals): 70.36,29.46 70.36,36.83 64.26,36.83 64.26,29.46
  pour Bottom (isolate 0.635, rank 2, no thermals): 32.26,29.46 32.26,36.83 26.16,36.83 26.16,29.46
  pour Bottom (isolate 0.635, rank 2, no thermals): 44.96,29.46 44.96,36.83 38.86,36.83 38.86,29.46
  pour Bottom (isolate 0.635, rank 2, no thermals): 57.66,29.46 57.66,36.83 51.56,36.83 51.56,29.46
  pour Bottom (isolate 0.635, rank 2, no thermals): 70.36,29.46 70.36,36.83 64.26,36.83 64.26,29.46
  pour Bottom (isolate 0.635, rank 4): 61.59,38.73 61.59,29.21 70.48,29.21 70.48,38.73
  pour Top (isolate 0.254): 13.34,26.67 13.34,34.29 15.24,36.2 15.24,38.1 13.97,38.1 3.43,29.21 3.43,26.67
  pour Bottom (isolate 0.635, rank 4): 22.86,38.73 22.86,29.21 32.38,29.21 32.38,38.73
  pour Bottom (isolate 0.635, rank 4): 36.2,38.73 36.2,29.21 45.09,29.21 45.09,38.73
  pour Bottom (isolate 0.635, rank 4): 48.9,38.73 48.9,29.21 57.78,29.21 57.78,38.73
VCC
  Top 0.406: U2.7 13.34,53.34 13.97,53.98 13.97,58.67 13.46,59.18 12.45,59.18 | C10.2 8.64,57.66 8.89,57.91 8.89,58.93 9.14,59.18 12.45,59.18 | R12.2 12.28,59.02 12.45,59.18

### Text on the board
tPlace: Aux + -
bPlace: Link to disable I-limit / (& Remove R15)
tNames: Bootloader | SWD | Mini-USB | I-Limit | Bridge A | Bridge B | + | + - / Motor Vin | A A | B B | Vin LED | Motor out
bNames: Jeroen Lodder / Okt - 2013 / Voor Embedded Vision Minor HAN / / Dual H-Bridge with Auxilary Low Side switch / Motor Vin 0 to 25 V (max 10A cont)
tDocu: Feature: Dual connector for Phoenix MSTB and cheap chinese screw terminal | Improvement: Move crystal Q9 away from Vin current conductor | Improvement: Do not run FET Gate traces parallel to current Vin cunductor | Dit is er handmatig op gelijmd